# EAGLE design DIAGONAL POLYPHONIC SEQUENCER SIMPLER VERSION v8 near final (EAGLE 9.3.0)
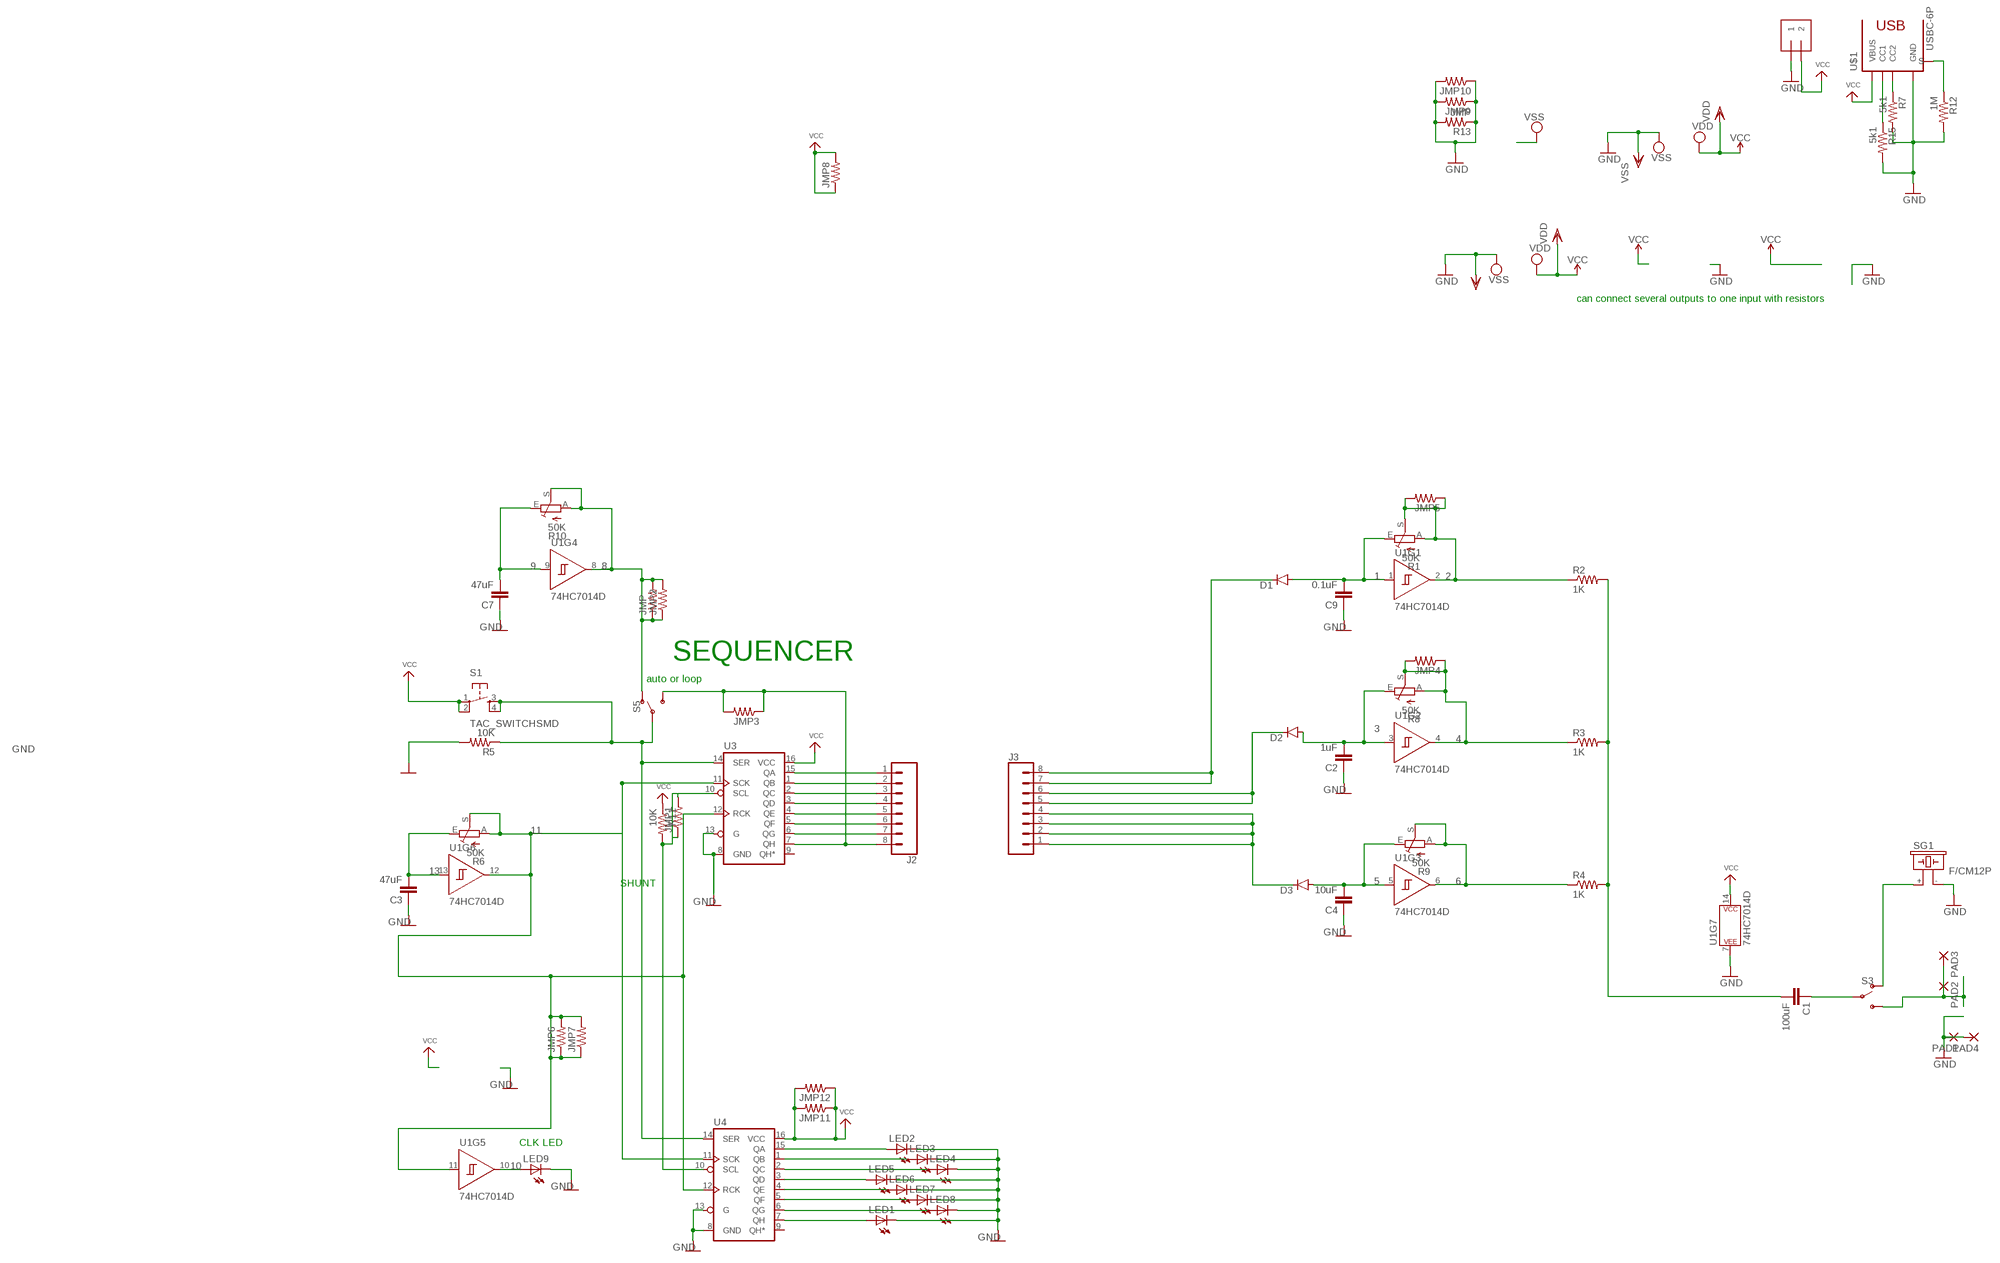
[diagram p0: schematic, sheet 1]

## Parts
C1  100uF  1.0UF-1206-50V-10%  [1206]
C2  1uF  1.0UF-1206-50V-10%  [1206]
C3  47uF  1.0UF-1206-50V-10%  [1206]
C4  10uF  1.0UF-1206-50V-10%  [1206]
C7  47uF  1.0UF-1206-50V-10%  [1206]
C9  0.1uF  1.0UF-1206-50V-10%  [1206]
D1  DIODEDO214AA  [DO-214AA]
D2  DIODEDO214AA  [DO-214AA]
D3  DIODEDO214AA  [DO-214AA]
J1  1X2-3.5MM  [1X2-3.5MM]
J2  CONN_08SMD-STRAIGHT-ALT-FEMALE  [1X08_SMD_ALT]
J3  CONN_08SMD-STRAIGHT-ALT-FEMALE  [1X08_SMD_ALT]
JMP  R-US_R1206  [R1206]
JMP1  R-US_R1206  [R1206]
JMP2  R-US_R1206  [R1206]
JMP3  R-US_R1206  [R1206]
JMP4  R-US_R1206  [R1206]
JMP5  R-US_R1206  [R1206]
JMP6  R-US_R1206  [R1206]
JMP7  R-US_R1206  [R1206]
JMP8  R-US_R1206  [R1206]
JMP9  R-US_R1206  [R1206]
JMP10  R-US_R1206  [R1206]
JMP11  R-US_R1206  [R1206]
JMP12  R-US_R1206  [R1206]
LED1  LEDCHIPLED_1206  [CHIPLED_1206]
LED2  LEDCHIPLED_1206  [CHIPLED_1206]
LED3  LEDCHIPLED_1206  [CHIPLED_1206]
LED4  LEDCHIPLED_1206  [CHIPLED_1206]
LED5  LEDCHIPLED_1206  [CHIPLED_1206]
LED6  LEDCHIPLED_1206  [CHIPLED_1206]
LED7  LEDCHIPLED_1206  [CHIPLED_1206]
LED8  LEDCHIPLED_1206  [CHIPLED_1206]
LED9  LEDCHIPLED_1206  [CHIPLED_1206]
PAD1  SMD5  [SMD2,54-5,08]
PAD2  SMD5  [SMD2,54-5,08]
PAD3  SMD5  [SMD2,54-5,08]
PAD4  SMD5  [SMD2,54-5,08]
R1  50K  TRIM_EU-CA9V  [CA9V]
R2  1K  R-US_R1206  [R1206]
R3  1K  R-US_R1206  [R1206]
R4  1K  R-US_R1206  [R1206]
R5  10K  R-US_R1206  [R1206]
R6  50K  TRIM_EU-CA9V  [CA9V]
R7  5k1  R-US_R1206  [R1206]
R8  50K  TRIM_EU-CA9V  [CA9V]
R9  50K  TRIM_EU-CA9V  [CA9V]
R10  50K  TRIM_EU-CA9V  [CA9V]
R11  10K  R-US_R1206  [R1206]
R12  1M  R-US_R1206  [R1206]
R13  JMP  R-US_R1206  [R1206]
R15  5k1  R-US_R1206  [R1206]
S1  TAC_SWITCHSMD  [TACTILE-SWITCH-SMD]
S3  SWITCH-SPDT-SMD-AYZ0202  [SWITCH_DPDT_SMD_AYZ0202]
S5  SWITCH-SPDT-SMD-AYZ0202  [SWITCH_DPDT_SMD_AYZ0202]
SG1  F/CM12P  [F/CM12P]
U1  74HC7014D  [SO14]
U3  74595  [TSSOP16]
U4  74595  [TSSOP16]
U$1  USBC-6P  [USCX-06FX-XXMX-01]

## Nets
1: C9.2 D1.A R1.E U1.1(A)
2: JMP5.1 JMP5.2 R1.A R1.S R2.1 U1.2(Y)
3: C2.2 D2.A R8.E U1.3(A)
4: JMP4.1 JMP4.2 R3.1 R8.A R8.S U1.4(Y)
5: C4.2 D3.A R9.E U1.5(A)
6: R4.1 R9.A R9.S U1.6(Y)
8: JMP2.1 JMP2.2 JMP.1 JMP.2 R10.A R10.S S5.1(O) U1.8(Y)
9: C7.2 R10.E U1.9(A)
10: LED9.A U1.10(Y)
11: JMP6.1 JMP6.2 JMP7.1 JMP7.2 R6.A R6.S U1.11(A) U1.12(Y) U3.11(SCK) U3.12(RCK) U4.11(SCK) U4.12(RCK)
13: C3.2 R6.E U1.13(A)
GND: C2.1 C3.1 C4.1 C7.1 C9.1 J1.1 JMP9.1 JMP9.2 JMP10.1 JMP10.2 LED1.C LED2.C LED3.C LED4.C LED5.C LED6.C LED7.C LED8.C LED9.C PAD1.1(P) PAD4.1(P) R5.2 R7.2 R12.2 R13.1 R13.2 R15.2 SG1.- U1.7(P$V-) U3.8(GND) U3.13(G) U4.8(GND) U4.13(G) U$1.GND1(GND) U$1.GND2(GND)
N$1: LED1.A U4.7(QH)
N$2: C1.2 R2.2 R3.2 R4.2
N$3: LED4.A U4.2(QC)
N$4: R7.1 U$1.CC2
N$5: LED2.A U4.15(QA)
N$6: LED3.A U4.1(QB)
N$8: C1.1 S3.2(P)
N$9: J2.1 U3.15(QA)
N$10: J2.2 U3.1(QB)
N$11: LED7.A U4.5(QF)
N$12: LED6.A U4.4(QE)
N$13: LED8.A U4.6(QG)
N$14: LED5.A U4.3(QD)
N$15: D3.C J3.1 J3.2 J3.3 J3.4
N$16: D2.C J3.5 J3.6
N$17: R15.1 U$1.CC1
N$18: J2.3 U3.2(QC)
N$19: PAD2.1(P) PAD3.1(P) S3.3(S)
N$20: S3.1(O) SG1.+
N$21: J2.4 U3.3(QD)
N$22: R12.1 U$1.SHIELD1(S) U$1.SHIELD2(S) U$1.SHIELD3(S) U$1.SHIELD4(S)
N$24: D1.C J3.7 J3.8
N$25: J2.5 U3.4(QE)
N$26: J2.6 U3.5(QF)
N$27: J2.7 U3.6(QG)
N$28: J2.8 JMP3.1 JMP3.2 S5.3(S) U3.7(QH)
N$33: R5.1 S1.3 S1.4 S5.2(P) U3.14(SER) U4.14(SER)
N$45: JMP1.1 JMP1.2 R11.2 U3.10(SCL) U4.10(SCL)
VCC: J1.2 JMP8.1 JMP8.2 JMP11.1 JMP11.2 JMP12.1 JMP12.2 R11.1 S1.1 S1.2 U1.14(P$V+) U3.16(VCC) U4.16(VCC) U$1.VBUS1(VBUS) U$1.VBUS2(VBUS)
Unconnected: U3.9(QH*) U4.9(QH*)

## Notes on the sheet
- can connect several outputs to one input with resistors
- SEQUENCER
- auto or loop
- SHUNT
- CLK LED

## Library data of the parts
C1-C4 C7 C9 = SparkFun-Capacitors:1.0UF: 1µF ceramic capacitors A capacitor is a passive two-terminal electrical component used to store electrical energy temporarily in an electric field.; PROD_ID: CAP-09822; VALUE: 1.0uF
D1-D3 = BeagleBone_Blue_R3:DIODE: Diode These are standard reverse protection diodes and small signal diodes. SMA package can handle up to about 1A. SOD-323 can handle about 200mA. What the SOD-323 package when ordering, there are some mfgs out there that are 5-pin packages.
J1 = adafruit:1X2: 3.5mm Terminal block http://www.ladyada.net/library/pcb/eaglelibrary.html
J2 J3 = SparkFun-Connectors:CONN_08: Multi connection point. Often used as Generic Header-pin footprint for 0.1 inch spaced/style header connections On any of the 0.1 inch spaced packages, you can populate with these: Break Away Headers - Straight <https://www.sparkfun.com/products/116> (PRT-00116) Break Away Male Headers - Right Angle <https://www.sparkfun.com/products/553> (PRT-00553) Female Headers <https://www.sparkfun.com/products/115> (PRT-00115) Break Away Headers - Machine Pin <https://www.sparkfun.com/products/117> (PRT-00117) Break Away Female Headers - Swiss Machine Pin <https://www.sparkfun.com/products/743> (PRT-00743) Arduino Stackable Header - 8 Pin <https://www.sparkfun.com/products/9279> (PRT-09279) For SCREWTERMINALS and SPRING TERMINALS visit here: Screw Terimnals on SparkFun.com <https://www.sparkfun.com/search/results?term=Screw+Terminals> (5mm/3.5mm/2.54mm spacing) This device is also useful as a general connection point to wire up your design to another part of your project. Our various solder wires solder well into these plated through hole pads. Hook-Up Wire - Assortment (Stranded, 22 AWG) <https://www.sparkfun.com/products/11375> (PRT-11375) Hook-Up Wire - Assortment (Solid Core, 22 AWG) <https://www.sparkfun.com/products/11367> (PRT-11367) View the entire wire category on our website here <https://www.sparkfun.com/categories/141> Special notes: Molex polarized connector foot print use with SKU : PRT-08231 with associated crimp pins and housings. 1MM SMD Version SKU: PRT-10208 NOTES ON THE VARIANTS LOCK and LOCK_LONGPADS... This footprint was designed to help hold the alignment of a through-hole component (i.e. 6-pin header) while soldering it into place. You may notice that each hole has been shifted either up or down by 0.005 of an inch from it's more standard position (which is a perfectly straight line). This slight alteration caused the pins (the squares in the middle) to touch the edges of the holes. Because they are alternating, it causes a "brace" to hold the component in place. 0.005 has proven to be the perfect amount of "off-center" position when using our standard breakaway headers. Although looks a little odd when you look at the bare footprint, once you have a header in there, the alteration is very hard to notice. Also,if you push a header all the way into place, it is covered up entirely on the bottom side.; PROD_ID: CONN-10204; SF_ID: PRT-11543
JMP JMP1-JMP12 R2-R5 R7 R11-R13 R15 = adafruit:R-US_: RESISTOR, American symbol
LED1-LED9 = adafruit:LED: LED OSRAM: - CHIPLED LG R971, LG N971, LY N971, LG Q971, LY Q971, LO R971, LY R971 LH N974, LH R974 LS Q976, LO Q976, LY Q976 LO Q996 - Hyper CHIPLED LW Q18S LB Q993, LB Q99A, LB R99A - SideLED LS A670, LO A670, LY A670, LG A670, LP A670 LB A673, LV A673, LT A673, LW A673 LH A674 LY A675 LS A676, LA A676, LO A676, LY A676, LW A676 LS A679, LY A679, LG A679 - Hyper Micro SIDELED® LS Y876, LA Y876, LO Y876, LY Y876 LT Y87S - SmartLED LW L88C, LW L88S LB L89C, LB L89S, LG L890 LS L89K, LO L89K, LY L89K LS L896, LA L896, LO L896, LY L896 - TOPLED LS T670, LO T670, LY T670, LG T670, LP T670 LSG T670, LSP T670, LSY T670, LOP T670, LYG T670 LG T671, LOG T671, LSG T671 LB T673, LV T673, LT T673, LW T673 LH T674 LS T676, LA T676, LO T676, LY T676, LB T676, LH T676, LSB T676, LW T676 LB T67C, LV T67C, LT T67C, LS T67K, LO T67K, LY T67K, LW E67C LS E67B, LA E67B, LO E67B, LY E67B, LB E67C, LV E67C, LT E67C LW T67C LS T679, LY T679, LG T679 LS T770, LO T770, LY T770, LG T770, LP T770 LB T773, LV T773, LT T773, LW T773 LH T774 LS E675, LA E675, LY E675, LS T675 LS T776, LA T776, LO T776, LY T776, LB T776 LHGB T686 LT T68C, LB T68C - Hyper Mini TOPLED® LB M676 - Mini TOPLED Santana® LG M470 LS M47K, LO M47K, LY M47K Source: http://www.osram.convergy.de/
PAD1-PAD4 = wirepad:SMD5: SMD PAD
R1 R6 R8-R10 = pot:TRIM_EU-: POTENTIOMETER
S1 = SparkFun-Retired:TAC_SWITCH: Momentary Switch Button commonly used for reset or general input. Spark Fun Electronics SKU : COM-00097 SMT- SWCH-08247; PROD_ID: SWCH-08247
S3 S5 = SparkFun-Switches:SWITCH-SPDT: Single Pole, Double Throw (SPDT) Switch Single-pole, double-throw (SPDT) switch. Variant Overview SMD-AYZ0202 Surface Mount DPDT Switch <https://www.sparkfun.com/products/597> (COM-00597) Used on e.g. LilyPad Arduino USB - ATmega32U4 Board <https://www.sparkfun.com/products/12049> PTH-11.6X4.0MM SPDT Mini Power Switch <https://www.sparkfun.com/products/102> (COM-00102) Used on e.g. SparkFun Simon Says - Through-Hole Soldering Kit <https://www.sparkfun.com/products/10547> (KIT-10547) PTH-11.6X4.0MM-KIT KIT version of SPDT Mini Power Switch - Simplifies soldering by removing tStop of switch pins - only one side can be soldered. PTH-11.6X4.0MM-LOCK LOCK version of SPDT Mini Power Switch - Offset pins hold switch in place for easier soldering. SMD-RIGHT-ANGLE Surface Mount Right Angle Switch <https://www.sparkfun.com/products/10860> (COM-10860) Used on e.g. SparkFun ESP8266 Thing <https://www.sparkfun.com/products/13231>; PROD_ID: SWCH-08179; SF_ID: COM-00597
SG1 = buzzer:F/CM12P: BUZZER Source: Buerklin; OC_FARNELL: unknown; OC_NEWARK: unknown
U1 = SparkFun-IC-Logic:74*7014: Schmitt-trigger Hex Buffer The 74HC7014 is a hex buffer with precision Schmitt-trigger inputs. The precisely defined trigger levels are lying in a window between (0.55 x VCC) and (0.65 x VCC). It makes the circuit suitable to operate in a highly noisy environment. Input shorts are allowed to -1.5 V and +16 V without disturbing other channels. Inputs include clamp diodes that enable the use of current limiting resistors to interface inputs to voltages in excess of VCC. Schmitt trigger inputs transform slowly changing input signals into sharply defined jitter-free output signals. SparkFun Products SparkFun Stepoko <https://www.sparkfun.com/products/13899> (ROB-13899); PROD_ID: IC-12527
U3 U4 = SparkFun-IC-Logic:74*595: 8-Bit Shift Register (Serial to Parallel) Datasheet <http://cdn.sparkfun.com/datasheets/BreakoutBoards/MM74HC595.pdf> SparkFun Products SparkFun Shift Register Breakout - 74HC595 <https://www.sparkfun.com/products/10680> (BOB-10680)
U$1 = USBC6P:USBC-6P: AliExpress Special! Connect 5.1k 10% resistors to each CC pin, pulled up to 3.3v or 5.0v.

## Board
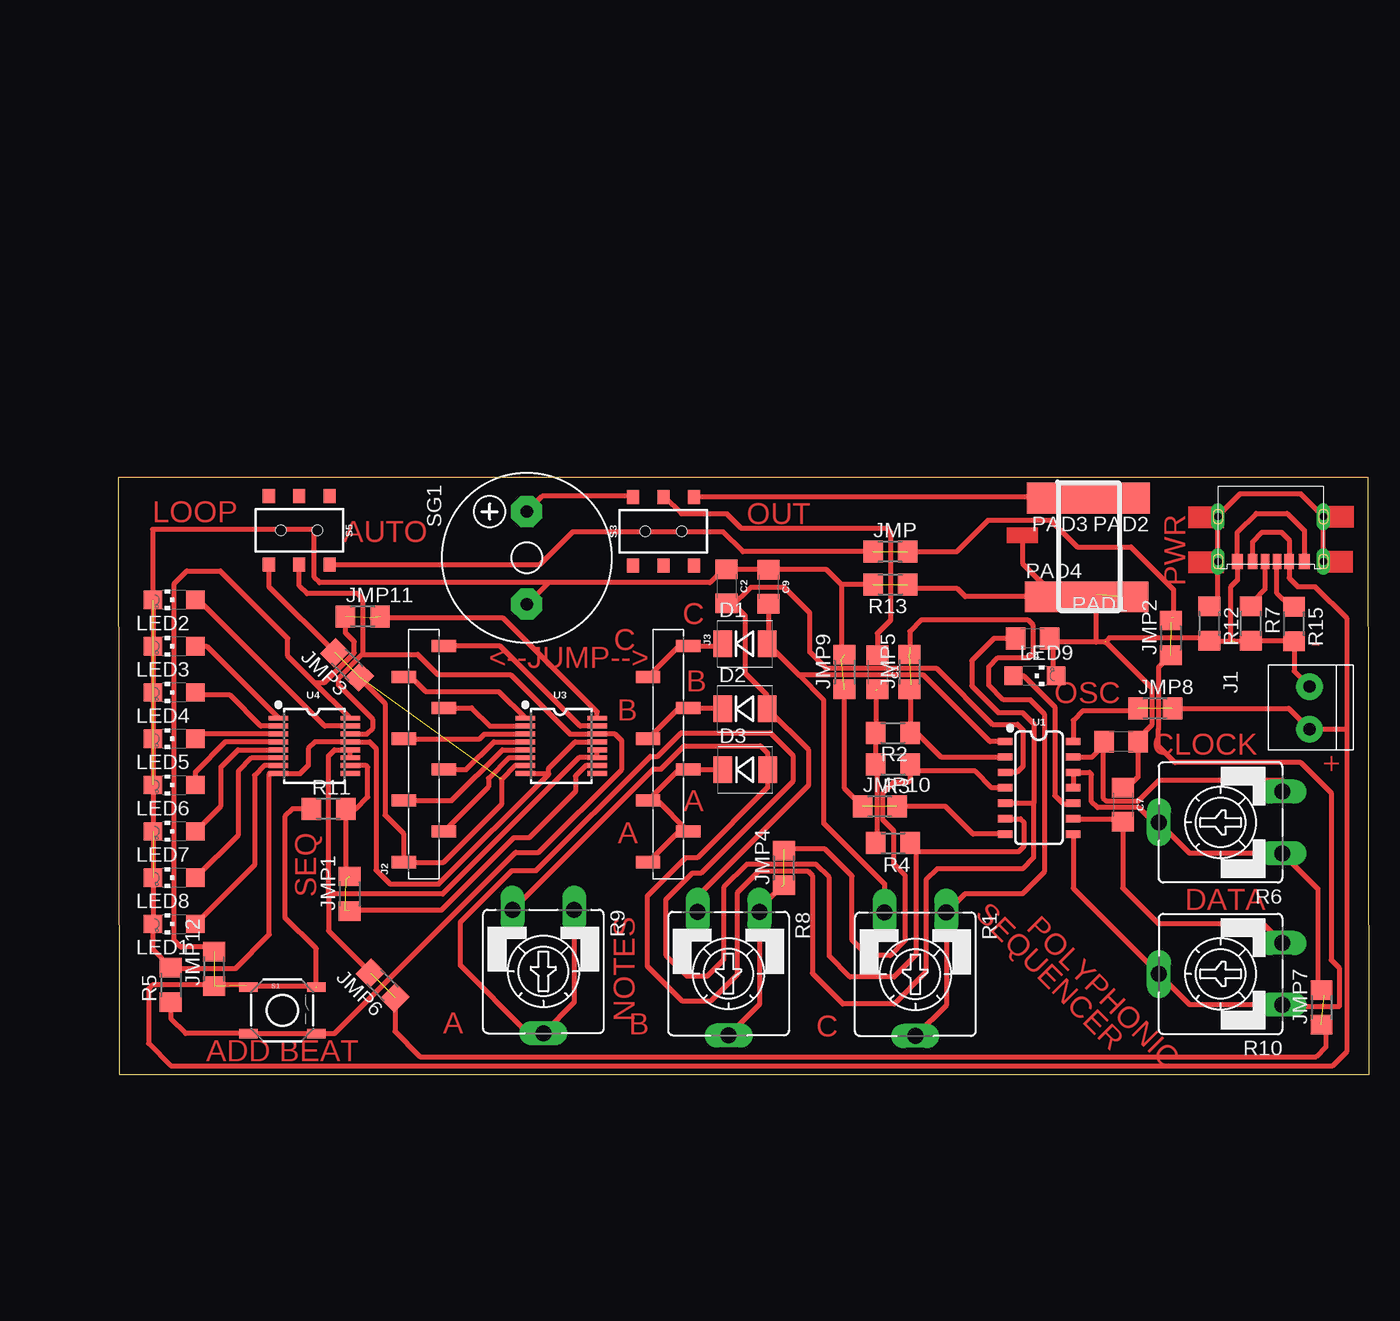
[diagram p1: board, top side]
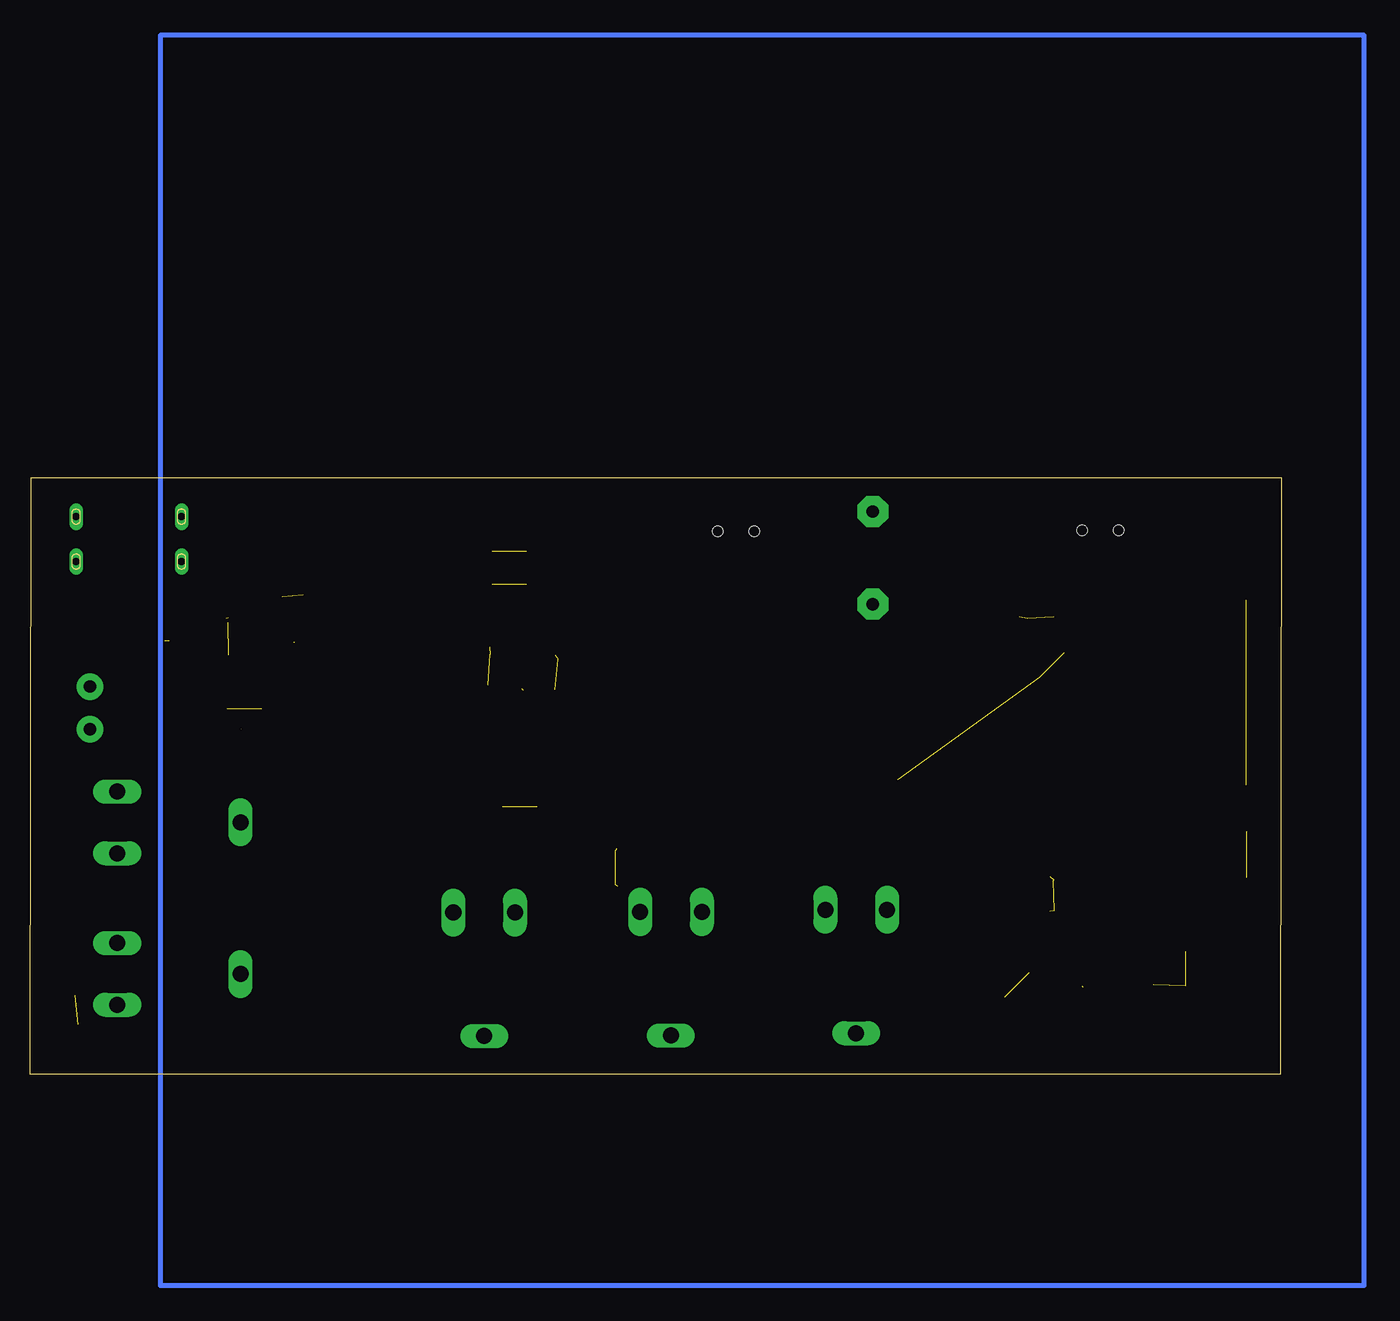
[diagram p2: board, bottom side, seen from below]

Size 102.93 x 49.1 mm. Coordinates in mm from the lower left corner, seen from the top.
Outline: 0.08,0 102.93,0 102.85,49.1 0,49.1 0.08,0
Copper layers (1*16): Top 0.035mm / dielectric 1.5mm / Bottom 0.035mm
Design rules "default *": minimum track width 16mil, minimum drill 0.35mm, track to track 6mil, track to pad 6mil, pad to pad 6mil, via to via 6mil, smd to smd 6mil, copper to edge 40mil, drill to drill 6mil, minimum pad ring 10mil, minimum via ring 8mil, stop-mask expansion 4mil, vias tented up to drill 0mil, thermal gap 10mil
Milling: 23 lines

### Footprints (pad centres in the part's own frame; a part is rotated, then mirrored left to right if it is on the bottom)
1206 = smd 1.6 x 1.8: 1 -1.4,0; 2 1.4,0
DO-214AA = smd 1.524 x 2.184: A 1.841,0; C -1.841,0
1X2-3.5MM = drill 1 pad 2.184: 1 1.8,0; 2 -1.7,0
1X08_SMD_ALT = smd 1 x 2: 1 0,-1.65; 2 -2.54,1.65; 3 -5.08,-1.65; 4 -7.62,1.65; 5 -10.16,-1.65; 6 -12.7,1.65; 7 -15.24,-1.65; 8 -17.78,1.65
R1206 = smd 1.6 x 1.803: 1 -1.422,0; 2 1.422,0
CHIPLED_1206 = smd 1.5 x 1.5: A 0,-1.75; C 0,1.75
SMD2,54-5,08 = smd 2.54 x 5.08: 1 0,0
CA9V = drill 1.321 long: A -2.54,-5.08; E 2.54,-5.08; S 0,5.08
TACTILE-SWITCH-SMD = smd 1.524 x 0.762: 1 -2.794,1.905; 2 2.794,1.905; 3 -2.794,-1.905; 4 2.794,-1.905
SWITCH_DPDT_SMD_AYZ0202 = smd 1 x 1.15: 1 -2.5,2.825; 2 0,2.825; 3 2.5,2.825; 4 -2.5,-2.825; 5 0,-2.825; 6 2.5,-2.825 | hole 0.85: 1.5,0; -1.5,0
F/CM12P = drill 1.016 pad 2.54 octagon: + 3.81,0; - -3.81,0
SO14 = smd 0.6 x 1.2: 1 -3.175,-2.8; 2 -1.905,-2.8; 3 -0.635,-2.8; 4 0.635,-2.8; 5 1.905,-2.8; 6 3.175,-2.8; 7 4.445,-2.8; 8 4.445,2.8; 9 3.175,2.8; 10 1.905,2.8; 11 0.635,2.8; 12 -0.635,2.8; 13 -1.905,2.8; 14 -3.175,2.8
TSSOP16 = smd 0.4 x 1.6: 1 -2.225,-2.85; 2 -1.575,-2.85; 3 -0.925,-2.85; 4 -0.275,-2.85; 5 0.375,-2.85; 6 1.025,-2.85; 7 1.675,-2.85; 8 2.325,-2.85; 9 2.325,3.05; 10 1.675,3.05; 11 1.025,3.05; 12 0.375,3.05; 13 -0.275,3.05; 14 -0.925,3.05; 15 -1.575,3.05; 16 -2.225,3.05
USCX-06FX-XXMX-01 = smd 0.7 x 1.2: CC1 0.5,-1.75; CC2 -0.5,-1.75 | smd 0.9 x 1.2: GND1 2.75,-1.75; GND2 -2.75,-1.75 | drill 0.6 long: SHIELD1 4.325,1.95; SHIELD2 4.325,-1.75; SHIELD3 -4.35,-1.75; SHIELD4 -4.35,1.95 | smd 0.8 x 1.2: VBUS1 1.5,-1.75; VBUS2 -1.5,-1.75

### Placement (x,y rotation side)
C1  62.46,33.09 270 top
C2  50.04,40.16 270 top
C3  82.52,27.37 180 top
C4  75.24,35.86 180 top
C7  82.65,22.2 270 top
C9  53.49,40.1 270 top
D1  51.56,35.43 0 top
D2  51.56,30.07 0 top
D3  51.59,25.07 0 top
J1  98.02,30.1 90 top
J2  25.15,35.23 90 top
J3  45.24,17.45 270 top
JMP  63.53,43 0 top
JMP1  19.02,14.86 90 top
JMP2  86.61,35.91 90 top
JMP3  18.83,33.69 135 top
JMP4  54.76,16.99 90 top
JMP5  65.1,33.12 90 top
JMP6  21.75,7.31 135 top
JMP7  99.01,5.51 90 top
JMP8  85.32,30.1 0 top
JMP9  59.77,33.09 90 top
JMP10  62.66,22.05 0 top
JMP11  20.12,37.67 0 top
JMP12  7.87,8.69 90 top
LED1  4.6,12.37 90 top
LED2  4.6,39.04 90 top
LED3  4.6,35.23 90 top
LED4  4.6,31.42 90 top
LED5  4.6,27.61 90 top
LED6  4.6,23.8 90 top
LED7  4.6,19.99 90 top
LED8  4.6,16.18 90 top
LED9  75.41,32.79 270 top
PAD1  82.22,39.29 90 top
PAD2  82.32,47.42 90 top
PAD3  77.29,47.42 90 top
PAD4  77.14,39.29 270 top
R1  65.58,8.23 180 top
R2  63.73,28.09 180 top
R3  63.75,25.5 180 top
R4  63.75,19.02 180 top
R5  4.32,7.34 90 top
R6  90.7,20.72 90 top
R7  93.19,37.08 270 top
R8  50.22,8.28 180 top
R9  34.98,8.46 180 top
R10  90.7,8.25 90 top
R11  17.3,21.84 0 top
R12  89.79,37.08 270 top
R13  63.53,40.31 180 top
R15  96.75,37.06 270 top
S1  13.49,5.26 0 top
S3  44.86,44.68 0 top
S5  14.88,44.75 180 top
SG1  33.6,42.49 90 top
U1  75.77,24.2 270 top
U3  36.35,27.07 270 top
U4  16.03,27.07 270 top
U$1  94.84,43.94 0 top

### Tracks (layer width: path | path; a pad name or v marks a point on that pad's centre or on a via)
1
  Top 0.406: 55.99,32.84 D1.A 53.49,35.52 C9.2 | 55.99,32.84 58.04,30.8 58.04,20.67 63.04,15.67 R1.E | 55.99,32.84 66.27,32.84 66.27,32.83 71.72,27.38 U1.1
2  (2 unrouted)
  Top 0.406: R1.S 68.12,5.69 R1.A 69.67,14.86 74.4,14.86 76.2,16.66 76.2,29.67 75.06,30.81 72.85,30.81 71.63,32.03 71.63,33.53 72.39,34.29 74.96,34.29 75.29,34.62 75.29,36.96 74.88,37.36 66.04,37.36 65.13,36.45 65.13,35.15 | 65.2,31.67 65.2,28.09 R2.1 65.7,28.09 67.69,26.11 U1.2 | 65.2,31.67 65.2,31.98 65.25,32.03 | JMP5.1 65.18,31.7 65.2,31.67
3
  Top 0.406: R8.E 47.68,11.94 47.78,11.83 47.78,14.76 56.77,23.75 56.77,26.71 D2.A 53.4,31.16 51.59,32.98 51.59,37.72 50.72,38.58 50.21,38.58 | 50.21,38.58 50.39,38.4 52.04,40.05 54.81,40.05 56.9,37.97 56.9,34.75 58.27,33.37 67.36,33.37 71.93,28.8 73.99,28.8 74.45,28.34 74.45,25.35 73.94,24.84 U1.3 | 50.21,38.58 C2.2
4  (3 unrouted)
  Top 0.406: R8.S 52.76,5.74 R8.A 52.76,13.66 54.56,15.47 | R3.1 65.73,24.94 70.51,24.94 71.88,23.57 U1.4 | R3.1 64.69,25.5 | 54.71,18.54 58.14,18.54 60.38,16.3 60.38,11.05 61.65,9.78 63.53,9.78 64.74,11 64.74,16.36 63.8,17.3 63.8,20.04 62.92,20.93 62.92,23.14 63.83,24.05 65,24.05 65.18,24.23 R3.1
5
  Top 0.406: C4.2 72.06,35.86 70.23,34.03 70.23,31.95 72.42,29.77 74.4,29.77 75.34,28.83 75.34,22.27 | R9.E 43.99,25.09 44.63,25.09 46.56,27.02 52.83,27.02 53.43,26.43 D3.A 53.43,23.58 47.65,17.8 46.66,17.8 43.51,14.65 43.51,8.91 46.38,6.04 48.77,6.04 50.95,8.23 50.95,14.96 52.71,16.71 56.74,16.71 57.1,16.36 57.1,8.3 59.61,5.79 63.86,5.79 66.47,8.41 66.47,16 67.39,16.91 74.42,16.91 75.34,17.83 75.34,22.27 | 75.34,22.27 72.99,22.27 U1.5
6
  Top 0.406: R9.A 37.52,5.92 R9.S 33.71,3.38 28.14,8.94 28.14,12.52 32.39,16.76 34.39,16.76 43.79,26.16 44.37,26.16 46.3,28.09 53.64,28.09 55.5,26.24 55.5,24.1 47.93,16.53 47.22,16.53 45.03,14.35 45.03,9.83 46.79,8.08 48.46,8.08 49.81,9.42 49.81,15.37 51.71,17.27 57.4,17.27 58.5,16.18 58.5,9.73 60.22,8 63.83,8 65.63,9.8 65.63,19.02 R4.1 65.89,18.31 74.07,18.31 74.5,18.74 74.5,20.78 74.24,21.03 U1.6
8  (4 unrouted)
  Top 0.406: R10.S 88.16,5.71 R10.A 95.94,5.56 100.46,5.56 100.46,8.74 99.8,9.4 99.8,23.16 97.31,25.65 86.96,25.65 85.6,27.01 85.6,28.4 | 85.06,8.89 85.06,8.81 R10.S | 61.8,43.31 JMP.1 51.38,43 49.73,44.65 37.41,44.65 34.69,41.93 S5.1 | JMP.2 68.99,43 71.58,45.59 76.71,45.59 78.91,43.39 83.32,43.39 86.82,39.9 86.82,37.54 JMP2.2 | 86.66,37.56 86.66,37.16 | JMP2.1 85.6,33.48 85.6,28.4 | U1.8 78.57,15.31 R10.S
9
  Top 0.406: R10.E 94.18,12.39 85.57,12.39 82.65,15.31 C7.2 82.42,21.03 U1.9
10
  Top 0.406: LED9.A 74.5,32.79 77.06,30.23 77.06,22.93 77.75,22.25 78.52,22.25 U1.10
11  (3 unrouted)
  Top 0.406: U3.12 U3.11 37.91,26.05 26.7,14.83 17.4,14.83 17.3,14.93 | 17.3,14.93 17.3,26.21 17.79,26.7 U4.12 U4.11 | 17.3,14.93 17.3,11.81 20.96,8.15 | JMP6.1 22.76,3.52 24.83,1.45 98.58,1.45 99.36,2.23 99.36,3.73 JMP7.1 | 99.24,6.48 99.24,6.7 JMP7.2 98.7,7.24 98.7,15.26 R6.A 88.16,18.18 R6.S 85.19,20.72 83.97,21.94 80.57,21.94 80.09,22.43 80.09,24.66 79.91,24.84 U1.12 U1.11
13
  Top 0.406: R6.E 95.78,24.2 85.65,24.2 83.92,22.48 81.31,22.48 81.03,22.76 81.03,27.27 C3.2 81.12,27.06 80.17,26.11 U1.13
GND  (12 unrouted)
  Top 0.406: U3.8 35.41,24.75 | 35.41,24.75 35.41,25.17 37.59,27.35 U3.13 | U$1.GND1 97.59,44.75 96.19,46.15 93.62,46.15 92.09,44.62 U$1.GND2 92.09,40.67 91.51,40.08 91.51,35.66 R12.2 89.54,35.91 81.53,35.91 81.18,35.56 80.47,35.56 | 91.87,35.66 R7.2 93.22,35.63 R15.2 96.75,33.17 J1.1 | 35.41,24.75 35.41,24.69 26.37,15.64 22.38,15.64 21.21,16.81 21.21,26.82 20.68,27.35 U4.13 16.18,27.35 15.62,26.8 15.62,25.4 14.97,24.75 U4.8 12.46,24.75 12.42,24.71 12.42,11.5 9.6,8.68 4.39,8.68 R5.2 4.32,8.79 2.85,10.26 LED1.C LED8.C LED2.C 2.82,39.06 2.82,44.83 16.13,44.83 16.13,40.89 16.55,40.46 35.38,40.46 | C2.1 53.44,41.56 | 53.44,41.56 53.7,41.56 53.72,41.53 58.29,41.53 59.51,40.31 | 53.44,41.56 C9.1 | C7.1 83.03,23.6 83.92,24.49 C3.1 83.92,27.62 85.04,28.74 85.04,31.8 81.28,35.56 | PAD4.1 78.97,39.29 79.17,39.5 80.47,39.5 80.47,35.56 | PAD4.1 69.7,39.29 69.04,39.95 65.3,39.95 R13.1 | 50.11,41.63 C2.1 | LED9.C 76.91,33.04 76.91,35.59 C4.1 76.94,35.56 80.47,35.56 | R13.2 59.51,40.31 | C2.1 49.76,41.56 48.67,40.46 35.38,40.46 | 59.51,40.31 59.51,34.16 59.49,34.14 | JMP10.1 59.77,23.52 JMP9.1 | U1.7 70.33,19.76 68.05,22.05 JMP10.2 | SG1.- 35.38,40.46 | PAD4.1 74.45,41.98 74.45,44.12
N$1
  Top 0.406: LED1.A 11.2,17.22 11.2,24.61 11.99,25.4 U4.7
N$2  (1 unrouted)
  Top 0.406: R4.2 62.41,19.1 62.41,25.42 R3.2 62.31,25.53 R2.2 62.36,28.14 62.36,31.59
N$3
  Top 0.406: U4.2 11.73,28.65 9.19,31.19 6.58,31.19 LED4.A
N$4
  Top 0.406: U$1.CC2 94.34,39.91 93.42,38.99 93.42,38.73 R7.1
N$5
  Top 0.406: U4.15 16.99,28.65 6.6,39.04 LED2.A
N$6
  Top 0.406: LED3.A 7.25,35.23 U4.1
N$7
  Bottom 0.406: -6.83,85.49 92.23,85.49 92.23,-17.38 -6.83,-17.38 -6.83,85.49
N$8
  Top 0.406: C1.1 62.46,36.27 63.54,37.35 63.54,44.61 63.22,44.93 51.26,44.93 50.05,46.14 46.32,46.14 44.96,47.5 S3.2
N$9
  Top 0.406: U3.15 38,28.65 31.42,35.23 J2.1
N$10
  Top 0.406: J2.2 24.11,32.69 25.3,31.49 31.3,31.49 U3.1
N$11
  Top 0.406: LED7.A 8.46,22.1 8.46,25.3 9.86,26.69 U4.5
N$12
  Top 0.406: U4.4 8.81,27.35 6.35,24.89 LED6.A
N$13
  Top 0.406: LED8.A 9.88,19.71 9.88,24.94 10.99,26.05 U4.6
N$14
  Top 0.406: U4.3 6.74,28 LED5.A
N$15
  Top 0.406: D3.C J3.4 46.13,25.07 J3.3 44.35,22.53 J3.2 46.13,19.99 J3.1
N$16
  Top 0.406: J3.5 46.13,30.15 J3.6 49.64,30.15 D2.C
N$17
  Top 0.406: R15.1 96.44,38.48 95.34,39.58 U$1.CC1
N$18
  Top 0.406: J2.3 29.08,30.15 30.58,28.65 U3.2
N$19
  Top 0.406: PAD2.1 PAD3.1 77.05,47.42 76.97,47.5 S3.3
N$20
  Top 0.406: S3.1 42.28,47.58 34.88,47.58 SG1.+
N$21
  Top 0.406: J2.4 29.74,27.61 30.14,28 U3.3
N$22
  Top 0.406: R12.1 90.49,39.21 U$1.SHIELD3 U$1.SHIELD4 90.49,45.94 92.3,47.75 97.31,47.75 U$1.SHIELD1 U$1.SHIELD2
N$23
  Top 0.406: 20.14,32.26 20.22,32.26 21.95,30.53 21.95,21.33 23.47,19.81 23.47,17.45
N$24
  Top 0.406: D1.C 49.52,35.23 J3.8 46.13,35.23 J3.7
N$25
  Top 0.406: J2.5 28.63,25.07 30.91,27.35 U3.4
N$26
  Top 0.406: J2.6 27.43,22.53 31.6,26.7 U3.5
N$27
  Top 0.406: J2.7 30.45,23.65 30.45,24.34 32.16,26.05 U3.6
N$28  (2 unrouted)
  Top 0.406: J2.8 26.77,17.45 31.52,22.2 31.52,24.28 32.64,25.4 U3.7 | S5.3 12.38,40.13 JMP3.2
N$33
  Top 0.406: U4.14 20.45,28 20.96,28.51 20.96,29.18 18.11,32.03 18.11,32.59 20.07,34.54 | R5.1 4.32,4.57 5.54,3.35 S1.3 S1.4 17.78,3.35 32.69,18.26 34.59,18.26 41.43,25.09 41.43,27.43 40.86,28 U3.14 37.15,28 32.26,32.89 26.29,32.89 24.64,34.54 20.07,34.54 | 20.07,34.54 20.12,34.59 20.12,39.11 19.69,39.55 15.52,39.55 14.88,40.18 S5.2
N$45  (3 unrouted)
  Top 0.406: U4.10 20.4,25.4 20.52,25.27 20.52,22.81 19.56,21.84 R11.2 18.72,16.58 JMP1.2 | U3.10 38.89,25.4 38.48,25.4 37.62,24.53 37.62,23.26 33.81,19.45 32.54,19.45 26.57,13.49 18.64,13.49 | 18.72,15.97 18.75,15.95
VCC  (6 unrouted)
  Top 0.406: U$1.VBUS2 93.34,43.81 94.13,44.6 95.71,44.6 96.34,43.96 U$1.VBUS1 96.34,40.84 97.08,40.1 98.5,40.1 101.12,37.49 101.12,28.4 | R11.1 14.33,21.84 13.69,21.21 13.69,12.93 16.28,10.34 S1.2 | 16.36,7.21 10.74,7.21 S1.1 10.52,7.34 2.79,7.34 2.49,7.03 2.49,2.54 4.32,0.71 99.92,0.71 101.12,1.9 101.12,28.4 | 101.12,28.4 J1.2 96.32,30.1 | 96.29,30.12 96.32,30.1 | JMP8.1 83.73,29.93 79.38,29.93 78.57,29.13 U1.14 | JMP8.2 96.32,30.1 | U3.16 39.4,29.82 31.67,37.54 20.88,37.54 | U4.16 16.12,32.25 | 16.12,32.25 13.94,34.43 13.94,35.86 8.38,41.43 5.64,41.43 4.6,40.38 4.6,11 5.13,10.46 7.52,10.46 JMP12.2 | 16.12,32.25 16.99,32.25 19.41,34.67 19.41,35.61 18.69,36.32 JMP11.1
(copper drawn outside any net)
  shapes: Top area x5

### Text on the board
Top: LOOP | PWR | AUTO | OUT | C | C | <--JUMP--> | - | B | OSC | B | CLOCK | + | A | A | SEQ | NOTES | SEQUENCER | DATA | POLYPHONIC | A | B | C | ADD BEAT